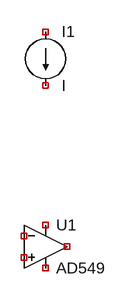
[diagram p0: schematic Draft2.asc]
Draft2.asc, the LTspice schematic file:
Version 4
SHEET 1 880 680
SYMBOL OpAmps\\AD549 176 96 R0
SYMATTR InstName U1
SYMBOL current 176 -160 R0
SYMATTR InstName I1

The netlist it stands for:
* Draft2.asc
XU1 NC_01 NC_02 NC_03 NC_04 NC_05 AD549  ; pins In+ In- V+ V- OUT
I1 NC_06 NC_07 I
.backanno
.end